# EAGLE design SB-FLOOR-LIGHTS (EAGLE 6.4)
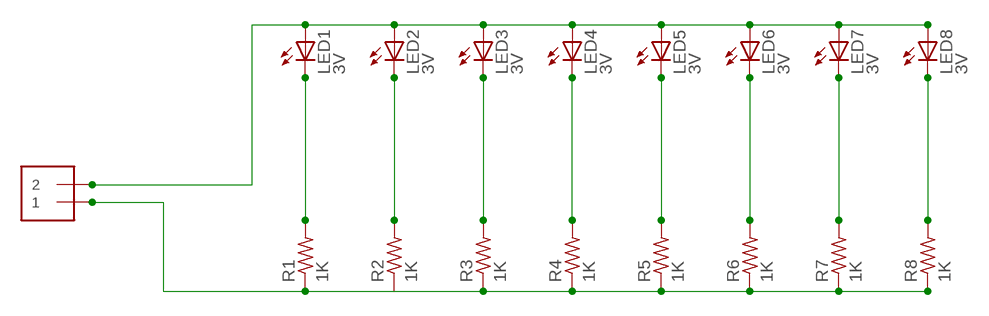
[diagram p0: schematic, sheet 1]

## Parts
J1  1X2-3.5MM  [1X2-3.5MM]
LED1  3V  LEDCHIPLED_0603  [CHIPLED_0603]
LED2  3V  LEDCHIPLED_0603  [CHIPLED_0603]
LED3  3V  LEDCHIPLED_0603  [CHIPLED_0603]
LED4  3V  LEDCHIPLED_0603  [CHIPLED_0603]
LED5  3V  LEDCHIPLED_0603  [CHIPLED_0603]
LED6  3V  LEDCHIPLED_0603  [CHIPLED_0603]
LED7  3V  LEDCHIPLED_0603  [CHIPLED_0603]
LED8  3V  LEDCHIPLED_0603  [CHIPLED_0603]
R1  1K  R-US_R0603  [R0603]
R2  1K  R-US_R0603  [R0603]
R3  1K  R-US_R0603  [R0603]
R4  1K  R-US_R0603  [R0603]
R5  1K  R-US_R0603  [R0603]
R6  1K  R-US_R0603  [R0603]
R7  1K  R-US_R0603  [R0603]
R8  1K  R-US_R0603  [R0603]

## Nets
N$2: J1.1 R1.1 R2.1 R3.1 R4.1 R5.1 R6.1 R7.1 R8.1
N$3: LED3.C R3.2
N$4: LED4.C R4.2
N$9: J1.2 LED1.A LED2.A LED3.A LED4.A LED5.A LED6.A LED7.A LED8.A
N$12: LED1.C R1.2
N$13: LED2.C R2.2
N$16: LED5.C R5.2
N$17: LED6.C R6.2
N$18: LED7.C R7.2
N$19: LED8.C R8.2

## Library data of the parts
J1 = adafruit:1X2: 3.5mm Terminal block http://www.ladyada.net/library/pcb/eaglelibrary.html
LED1-LED8 = adafruit:LED: LED OSRAM: - CHIPLED LG R971, LG N971, LY N971, LG Q971, LY Q971, LO R971, LY R971 LH N974, LH R974 LS Q976, LO Q976, LY Q976 LO Q996 - Hyper CHIPLED LW Q18S LB Q993, LB Q99A, LB R99A - SideLED LS A670, LO A670, LY A670, LG A670, LP A670 LB A673, LV A673, LT A673, LW A673 LH A674 LY A675 LS A676, LA A676, LO A676, LY A676, LW A676 LS A679, LY A679, LG A679 - Hyper Micro SIDELED® LS Y876, LA Y876, LO Y876, LY Y876 LT Y87S - SmartLED LW L88C, LW L88S LB L89C, LB L89S, LG L890 LS L89K, LO L89K, LY L89K LS L896, LA L896, LO L896, LY L896 - TOPLED LS T670, LO T670, LY T670, LG T670, LP T670 LSG T670, LSP T670, LSY T670, LOP T670, LYG T670 LG T671, LOG T671, LSG T671 LB T673, LV T673, LT T673, LW T673 LH T674 LS T676, LA T676, LO T676, LY T676, LB T676, LH T676, LSB T676, LW T676 LB T67C, LV T67C, LT T67C, LS T67K, LO T67K, LY T67K, LW E67C LS E67B, LA E67B, LO E67B, LY E67B, LB E67C, LV E67C, LT E67C LW T67C LS T679, LY T679, LG T679 LS T770, LO T770, LY T770, LG T770, LP T770 LB T773, LV T773, LT T773, LW T773 LH T774 LS E675, LA E675, LY E675, LS T675 LS T776, LA T776, LO T776, LY T776, LB T776 LHGB T686 LT T68C, LB T68C - Hyper Mini TOPLED® LB M676 - Mini TOPLED Santana® LG M470 LS M47K, LO M47K, LY M47K Source: http://www.osram.convergy.de/
R1-R8 = adafruit:R-US_: RESISTOR, American symbol

## Board
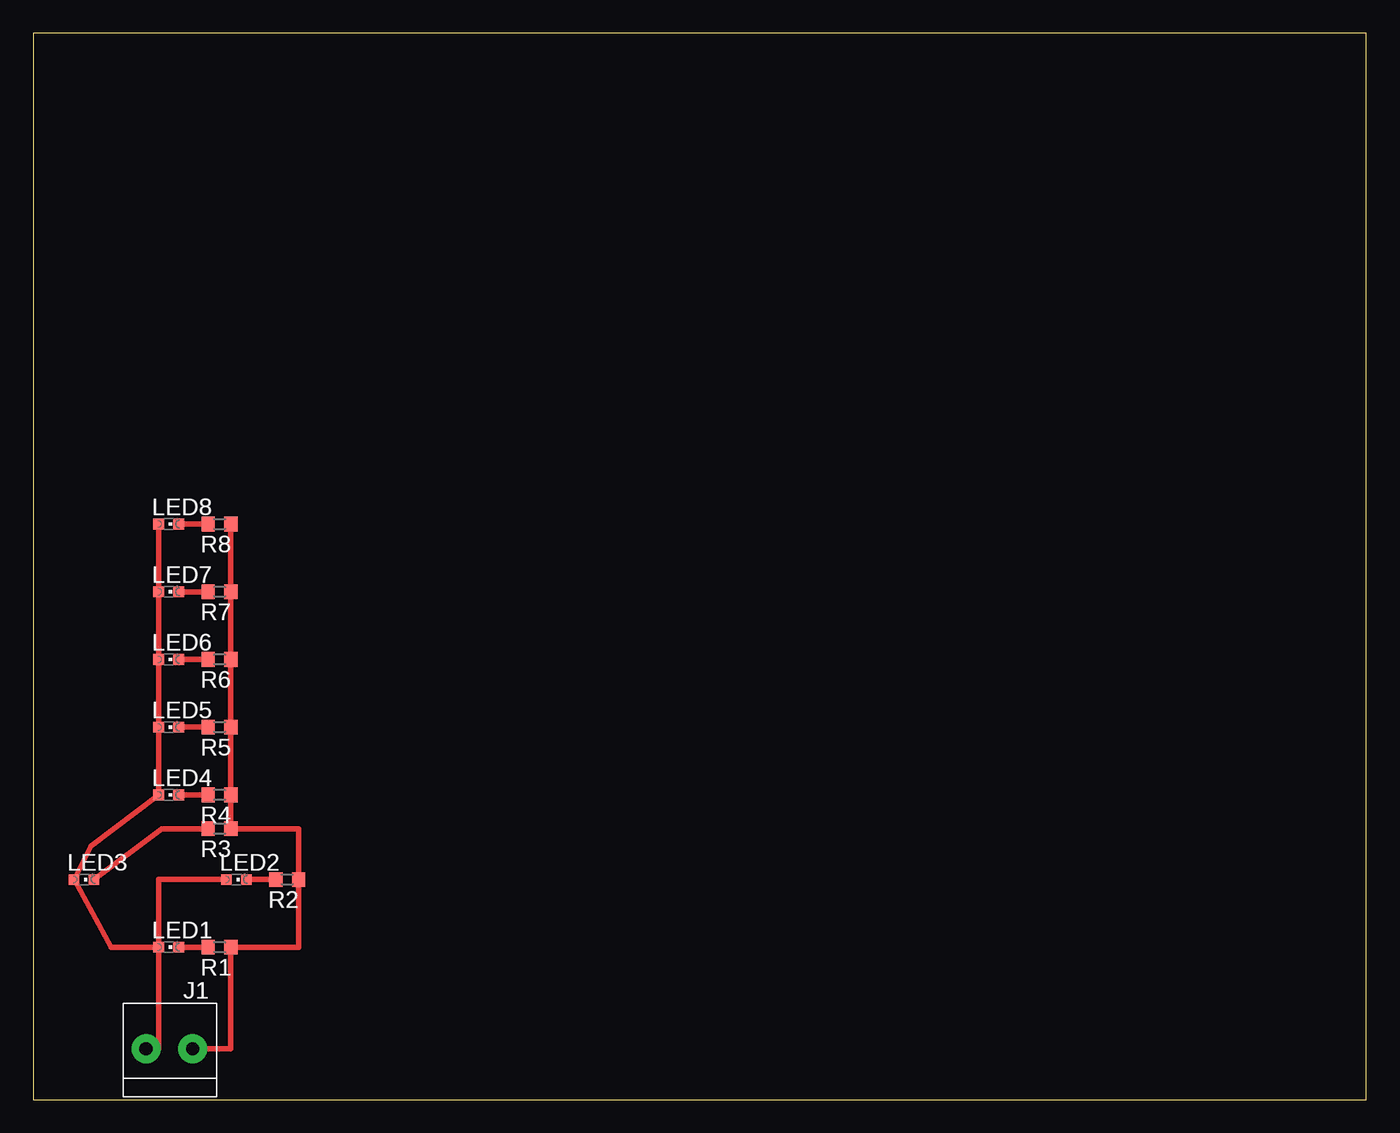
[diagram p1: board, top side]

Size 100 x 80 mm. Coordinates in mm from the lower left corner, seen from the top.
Outline: 0,0 100,0 100,80 0,80 0,0
Copper layers (1*16): Top 0.035mm / dielectric 1.5mm / Bottom 0.035mm
Design rules "default": minimum track width 10mil, minimum drill 24mil, track to track 8mil, track to pad 8mil, pad to pad 8mil, via to via 8mil, smd to smd 8mil, copper to edge 40mil, drill to drill 8mil, minimum pad ring 10mil, minimum via ring 8mil, stop-mask expansion 4mil, vias tented up to drill 0mil, thermal gap 10mil

### Footprints (pad centres in the part's own frame; a part is rotated, then mirrored left to right if it is on the bottom)
1X2-3.5MM = drill 1 pad 2.184: 1 1.8,0; 2 -1.7,0
CHIPLED_0603 = smd 0.8 x 0.8: A 0,-0.75; C 0,0.75
R0603 = smd 1 x 1.1: 1 -0.85,0; 2 0.85,0

### Placement (x,y rotation side)
J1  10.16,3.81 0 top
LED1  10.16,11.43 270 top
LED2  15.24,16.51 270 top
LED3  3.81,16.51 270 top
LED4  10.16,22.86 270 top
LED5  10.16,27.94 270 top
LED6  10.16,33.02 270 top
LED7  10.16,38.1 270 top
LED8  10.16,43.18 270 top
R1  13.97,11.43 180 top
R2  19.05,16.51 180 top
R3  13.97,20.32 180 top
R4  13.97,22.86 180 top
R5  13.97,27.94 180 top
R6  13.97,33.02 180 top
R7  13.97,38.1 180 top
R8  13.97,43.18 180 top

### Tracks (layer width: path | path; a pad name or v marks a point on that pad's centre or on a via)
N$2
  Top 0.406: R8.1 R7.1 R6.1 R5.1 R4.1 R3.1 19.9,20.32 R2.1 19.9,11.43 R1.1 14.82,3.81 J1.1
N$3
  Top 0.406: LED3.C 9.64,20.32 R3.2
N$4
  Top 0.406: LED4.C R4.2
N$9
  Top 0.406: LED1.A 5.83,11.43 LED3.A 4.33,19.05 LED4.A LED5.A LED6.A LED7.A LED8.A | LED1.A 9.41,16.51 LED2.A | LED1.A 9.41,3.81 J1.2
N$12
  Top 0.406: LED1.C R1.2
N$13
  Top 0.406: LED2.C R2.2
N$16
  Top 0.406: LED5.C R5.2
N$17
  Top 0.406: LED6.C R6.2
N$18
  Top 0.406: LED7.C R7.2
N$19
  Top 0.406: LED8.C R8.2

### Text on the board
_tNames: LED8 | R8 | LED7 | R7 | LED6 | R6 | LED5 | R5 | LED4 | R4 | R3 | LED3 | LED2 | R2 | LED1 | R1 | J1